# EAGLE design Light module (EAGLE 9.6.2)
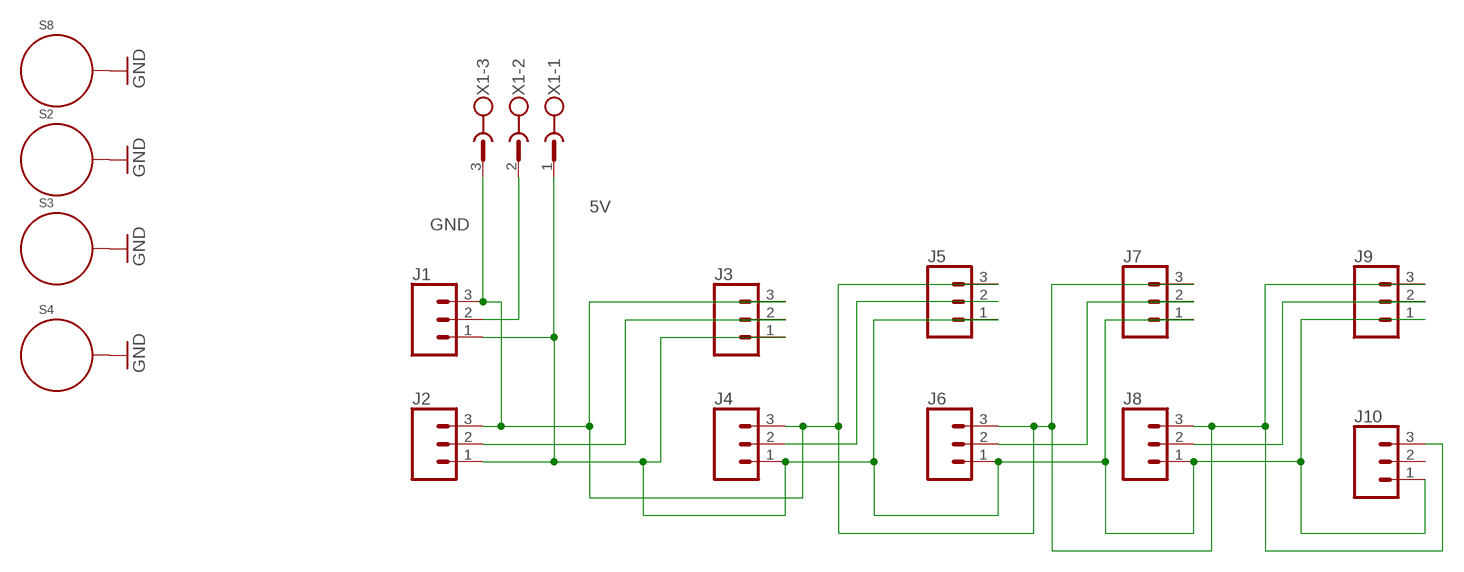
[diagram p0: schematic, sheet 1]

## Parts
J1  JST_CONN_03  [HEADER_PIN_1X03]
J2  JST_CONN_03  [HEADER_PIN_1X03]
J3  JST_CONN_03  [HEADER_PIN_1X03]
J4  JST_CONN_03  [HEADER_PIN_1X03]
J5  JST_CONN_03  [HEADER_PIN_1X03]
J6  JST_CONN_03  [HEADER_PIN_1X03]
J7  JST_CONN_03  [HEADER_PIN_1X03]
J8  JST_CONN_03  [HEADER_PIN_1X03]
J9  JST_CONN_03  [HEADER_PIN_1X03]
J10  JST_CONN_03  [HEADER_PIN_1X03]
S2  STANDOFF_ELECTRICAL5-32  [STANDOFF_ELECTRICAL_5_32]
S3  STANDOFF_ELECTRICAL5-32  [STANDOFF_ELECTRICAL_5_32]
S4  STANDOFF_ELECTRICAL5-32  [STANDOFF_ELECTRICAL_5_32]
S8  STANDOFF_ELECTRICAL5-32  [STANDOFF_ELECTRICAL_5_32]
X1  PHOENIX_508_3PIN  [PHOENIX_508_3PIN]

## Nets
5V [PWR]: J1.1 J2.1 J3.1 J4.1 J5.1 J6.1 J7.1 J8.1 J9.1 J10.1 X1.1
GND [PWR]: J1.3 J2.3 J3.3 J4.3 J5.3 J6.3 J7.3 J8.3 J9.3 J10.3 S2.P1 S3.P1 S4.P1 S8.P1 X1.3
N$2: J1.2 X1.2
N$5: J2.2 J3.2
N$8: J4.2 J5.2
N$11: J6.2 J7.2
N$14: J8.2 J9.2
Unconnected: J10.2

## Library data of the parts
J1-J10 = OMSI_Default_V1:JST_CONN_03: Multi connection point. Often used as Generic Header-pin footprint for 0.1 inch spaced/style header connections On any of the 0.1 inch spaced packages, you can populate with these: Break Away Headers - Straight <https://www.sparkfun.com/products/116> (PRT-00116) Break Away Male Headers - Right Angle <https://www.sparkfun.com/products/553> (PRT-00553) Female Headers <https://www.sparkfun.com/products/115> (PRT-00115) Break Away Headers - Machine Pin <https://www.sparkfun.com/products/117> (PRT-00117) Break Away Female Headers - Swiss Machine Pin <https://www.sparkfun.com/products/743> (PRT-00743) Stackable Header - 3 Pin (Female, 0.1") <https://www.sparkfun.com/products/13875> (PRT-13875) For SCREWTERMINALS and SPRING TERMINALS visit here: Screw Terimnals on SparkFun.com <https://www.sparkfun.com/search/results?term=Screw+Terminals> (5mm/3.5mm/2.54mm spacing) This device is also useful as a general connection point to wire up your design to another part of your project. Our various solder wires solder well into these plated through hole pads. Hook-Up Wire - Assortment (Stranded, 22 AWG) <https://www.sparkfun.com/products/11375> (PRT-11375) Hook-Up Wire - Assortment (Solid Core, 22 AWG) <https://www.sparkfun.com/products/11367> (PRT-11367) View the entire wire category on our website here <https://www.sparkfun.com/categories/141> Special notes: Molex polarized connector foot print use with SKU : PRT-08232 with associated crimp pins and housings.; PROD_ID: CONN-11912; SF_SKU: PRT-08433
S2-S4 S8 = th_libraries:STANDOFF_ELECTRICAL: A standoff intended to be an electrically connected point. Pad size and stop size allow for a #8 Phillips pan screw head to make a solid connection to the board. Added 144mill drill hole that fits my normal wood screw
X1 = OMSI_Default_V1:PHOENIX_508_3PIN: PHOENIX; MF: FARNELL; MPN: 1757255; OC_FARNELL: 3705183; OC_NEWARK: 71C4162

## Net classes
0 default: width 0.406 mm, drill 0.483 mm
1 PWR: width 0.635 mm, clearance 0.381 mm

## Board
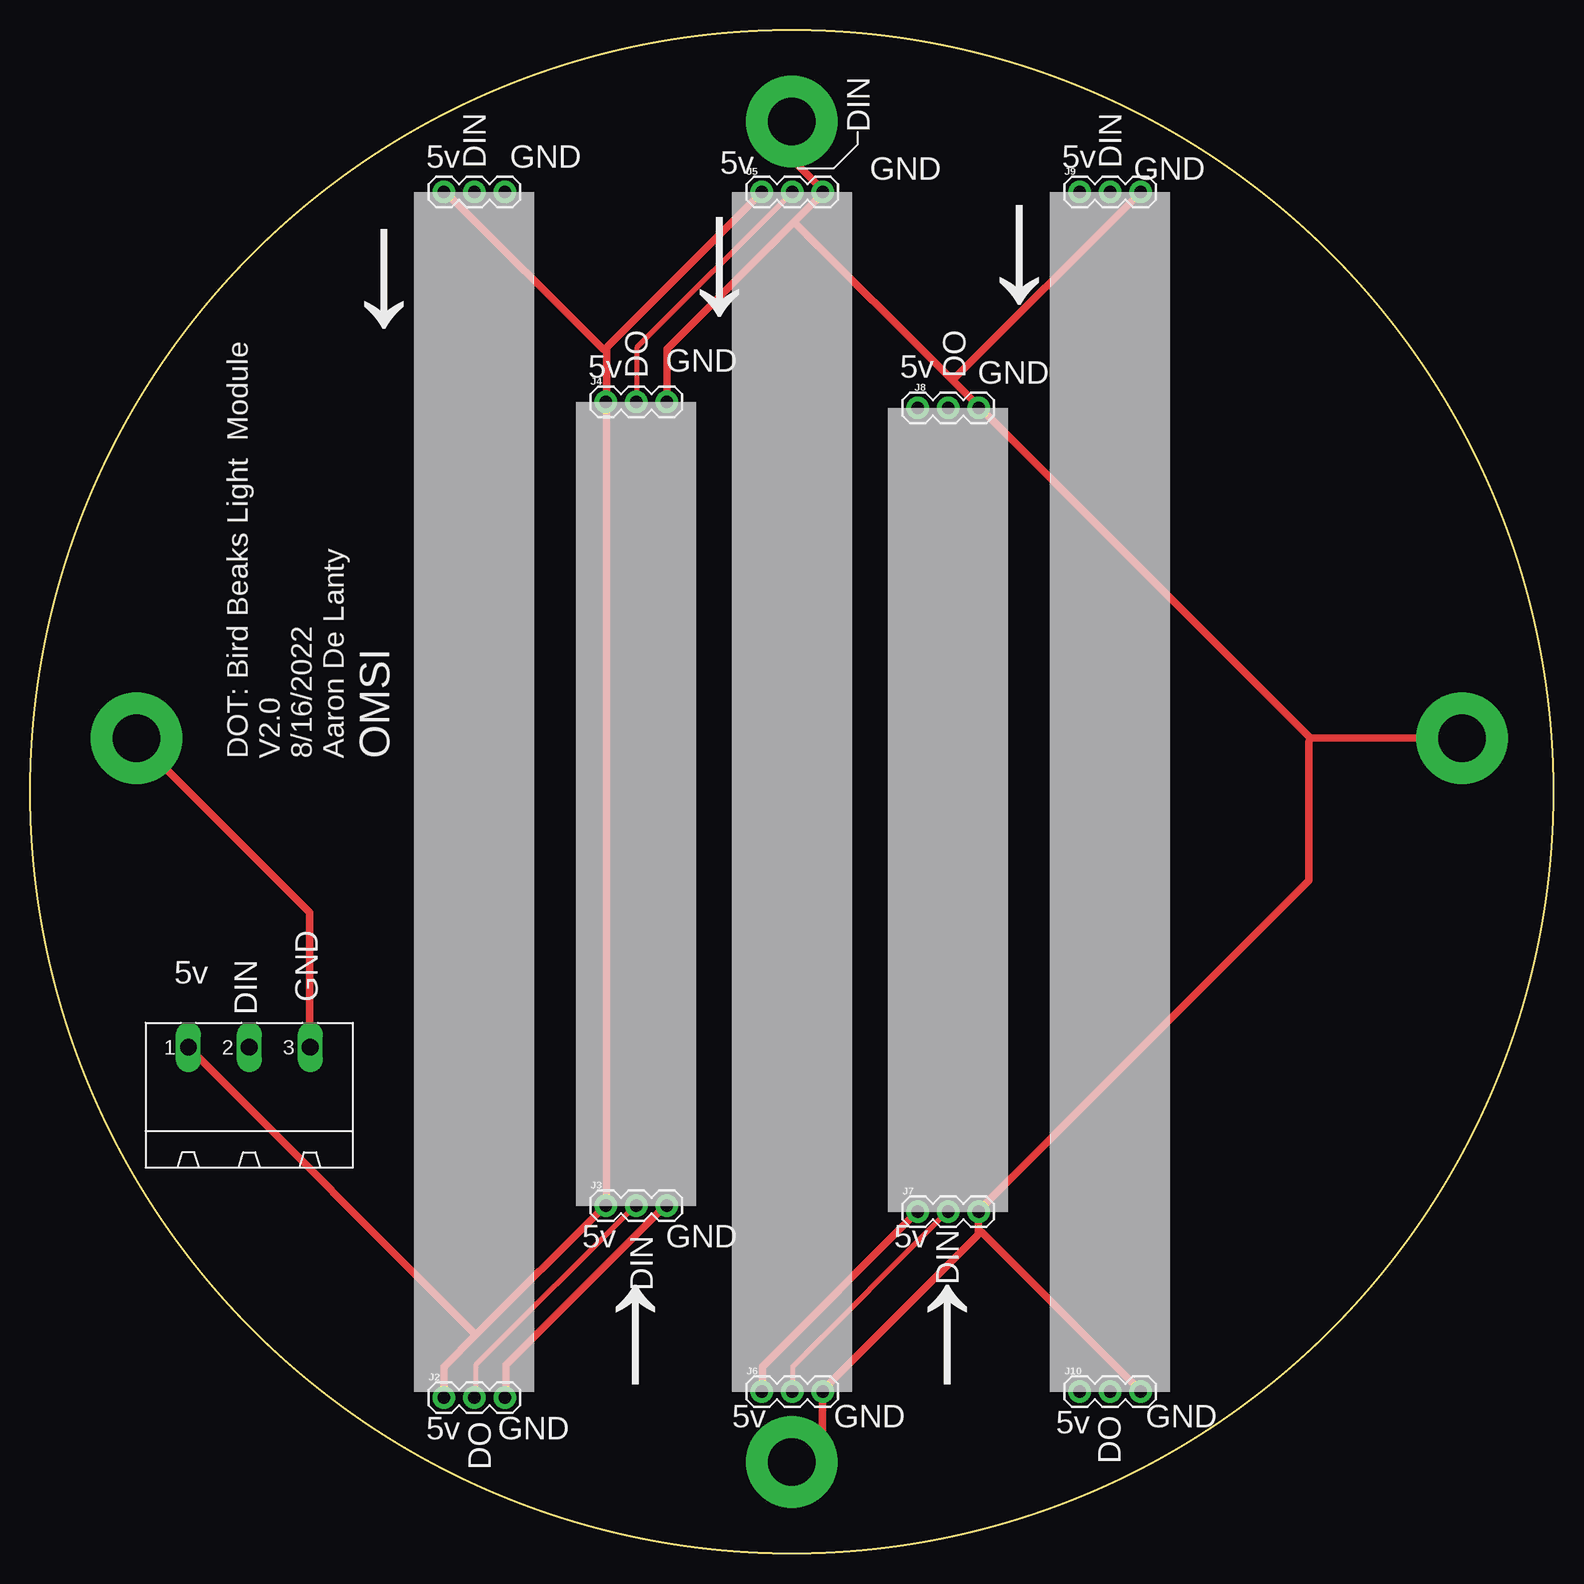
[diagram p1: board, top side]
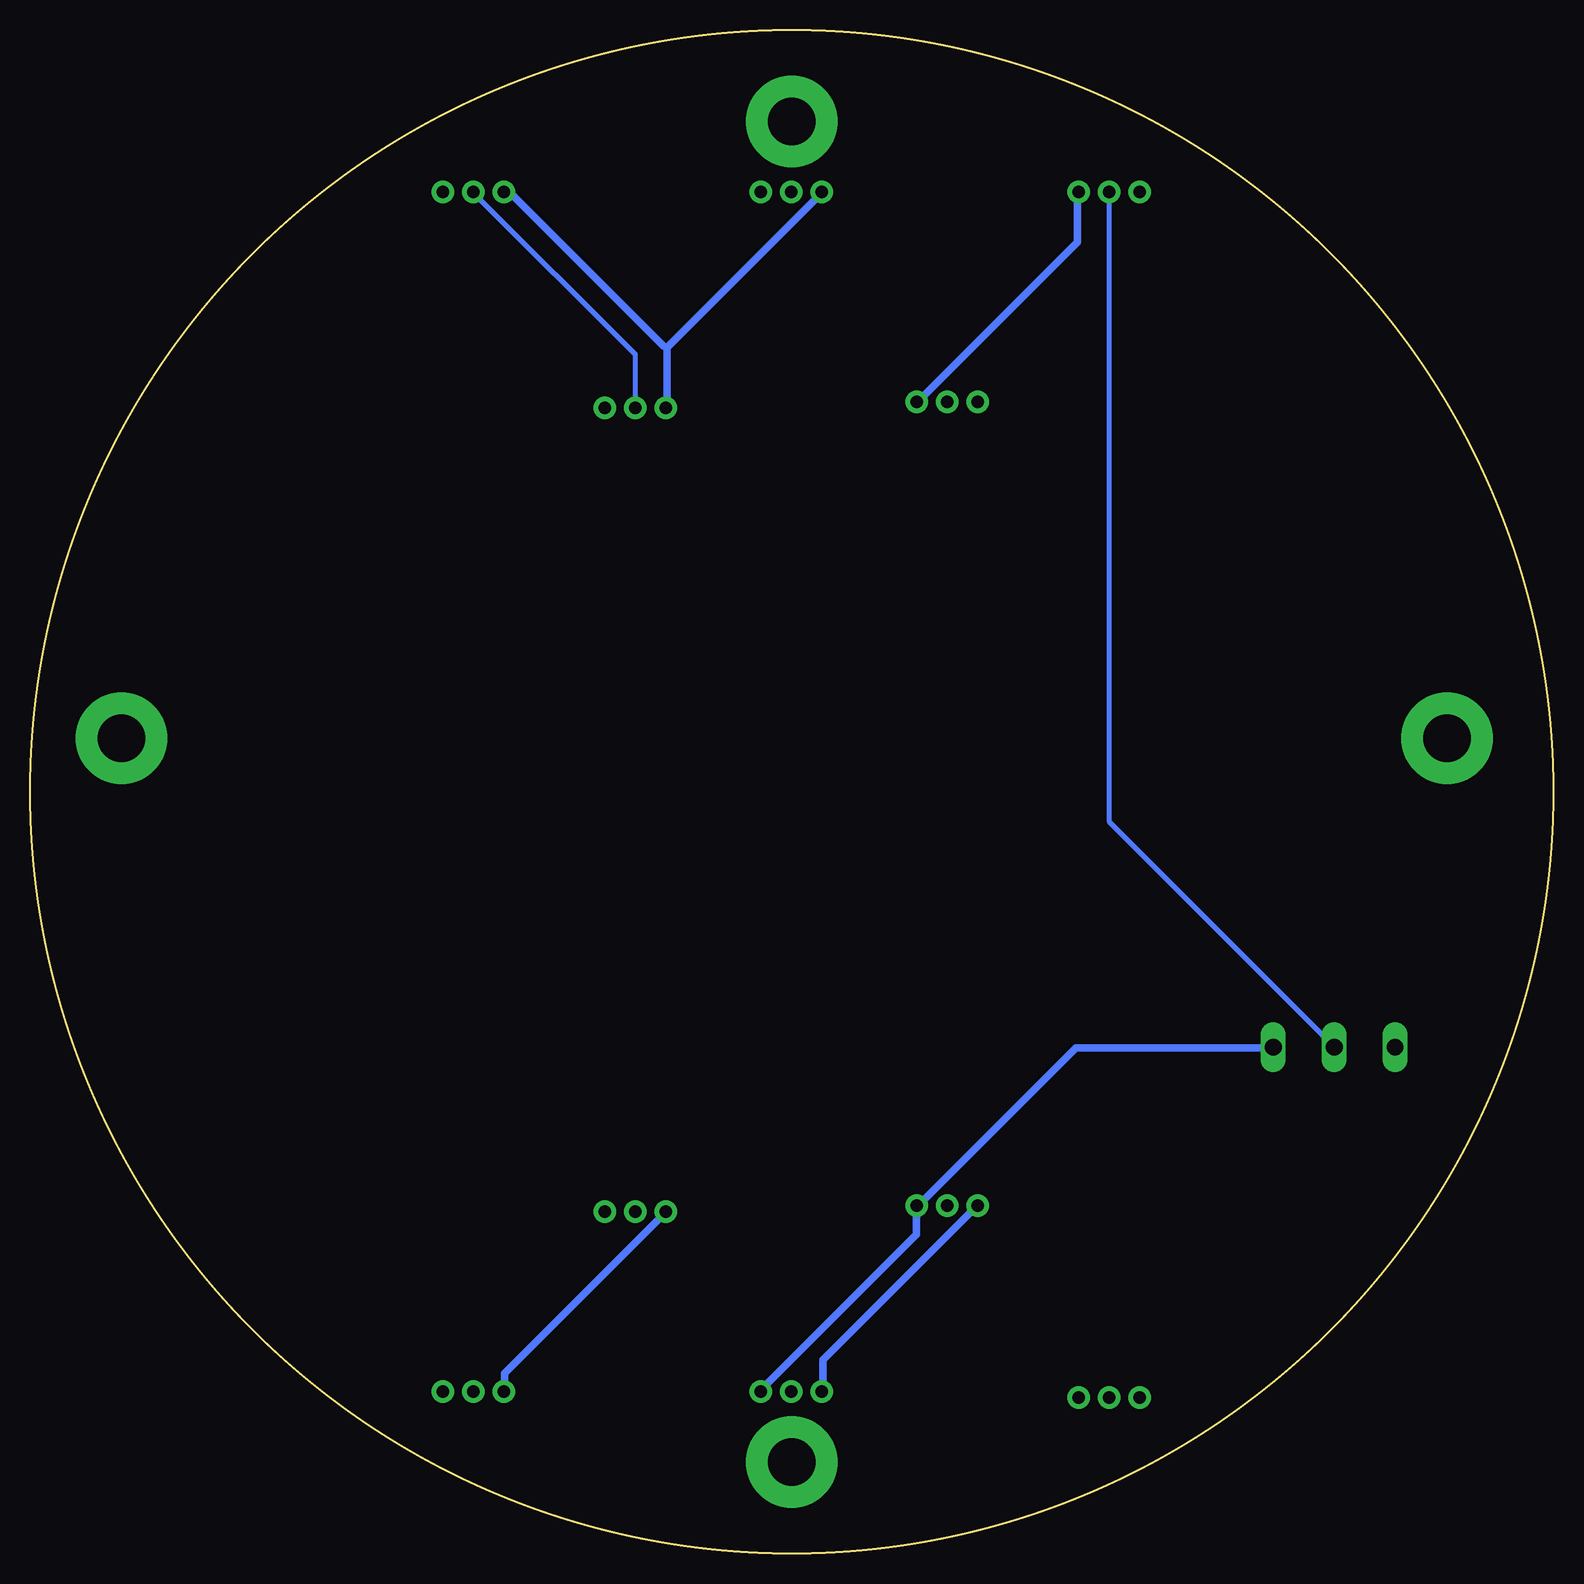
[diagram p2: board, bottom side, seen from below]

Size 127 x 127 mm. Coordinates in mm from the lower left corner, seen from the top.
Outline: circle at 63.5,63.5 radius 63.5
Copper layers (1*16): Top 0.035mm / dielectric 1.5mm / Bottom 0.035mm
Design rules "default": minimum track width 6mil, minimum drill 0.35mm, track to track 6mil, track to pad 6mil, pad to pad 6mil, via to via 6mil, smd to smd 6mil, copper to edge 40mil, drill to drill 6mil, minimum pad ring 10mil, minimum via ring 8mil, stop-mask expansion 4mil, vias tented up to drill 0mil, thermal gap 10mil

### Footprints (pad centres in the part's own frame; a part is rotated, then mirrored left to right if it is on the bottom)
HEADER_PIN_1X03 = drill 1.016 pad 1.88: 1 0,0; 2 2.54,0; 3 5.08,0
STANDOFF_ELECTRICAL_5_32 = drill 3.969 pad 7.62: P1 0,0
PHOENIX_508_3PIN = drill 1.397 long: 1 -5.08,5.08; 2 0,5.08; 3 5.08,5.08

### Placement (x,y rotation side)
J1  34.5,113.5 0 top
J2  34.5,13 0 top
J3  48,29 0 top
J4  48,96 0 top
J5  61,113.5 0 top
J6  61,13.5 0 top
J7  74,28.5 0 top
J8  74,95.5 0 top
J9  87.5,113.5 0 top
J10  87.5,13.5 0 top
S2  63.5,7.62 0 top
S3  8.89,67.94 0 top
S4  119.38,67.94 0 top
S8  63.5,119.38 0 top
X1  18.28,37.13 0 top

### Tracks (layer width: path | path; a pad name or v marks a point on that pad's centre or on a via)
5V
  Top 0.635: 48.06,100.38 48.06,100.52 60.91,113.37 J5.1 | 48.06,100.38 48.06,96.05 J4.1 48.06,95.77 48.06,29.27 J3.1 47.92,28.99 37.16,18.24 | J1.1 34.51,113.37 34.78,113.37 47.78,100.38 48.06,100.38 | J6.1 61.05,13.63 61.05,15.58 73.9,28.44 J7.1 | 37.16,18.24 34.51,15.58 34.51,13.07 J2.1 | 37.16,18.24 13.27,42.13 X1.1
  Bottom 0.635: 73.9,100.52 73.9,95.63 J8.1 | 73.9,100.52 61.05,113.37 J5.1 | J9.1 87.45,113.37 86.89,113.37 74.18,100.66 73.9,100.52 | J10.1 87.45,13.63 87.45,15.02 74.04,28.44 J7.1 | J6.1 60.91,13.63 60.91,16.14 48.06,28.99 J3.1
GND
  Top 0.635: 63.7,111 66.08,113.37 J5.3 65.94,113.79 63.56,116.17 63.56,119.38 S8.P1 | 63.7,111 53.09,100.38 53.09,96.05 J4.3 | 63.7,111 76.91,97.8 | 76.91,97.8 79.07,95.63 J8.3 79.35,95.35 106.73,67.97 | 76.91,97.8 92.48,113.37 J9.3 | 106.73,67.97 119.3,67.97 S4.P1 | X1.3 23.33,42.27 23.33,53.44 8.94,67.83 S3.P1 | J2.3 39.67,13.07 39.67,15.72 52.95,28.99 J3.3 | S2.P1 63.56,7.62 66.08,10.13 66.08,13.49 J6.3 66.22,13.77 79.07,26.62 79.07,26.76 | 79.07,26.76 79.07,28.44 J7.3 79.21,28.72 106.59,56.1 106.59,67.69 106.73,67.97 | J10.3 92.48,13.63 79.35,26.76 79.07,26.76
  Bottom 0.635: J1.3 39.67,113.37 39.67,109.32 52.95,96.05 J4.3 | J6.3 66.08,13.63 53.09,26.62 J3.3 52.81,29.13 39.81,42.13 23.47,42.13 X1.3
N$2
  Bottom 0.406: J1.2 37.02,113.37 37.02,60.98 18.3,42.27 X1.2
N$5
  Top 0.406: J2.2 37.16,13.07 37.16,15.72 50.43,28.99 J3.2
N$8
  Top 0.406: J4.2 50.57,96.05 50.57,100.52 63.42,113.37 J5.2
N$11
  Top 0.406: J6.2 63.56,13.63 63.56,15.58 76.42,28.44 J7.2
N$14
  Bottom 0.406: J8.2 76.56,95.63 76.56,99.96 89.97,113.37 J9.2

### Text on the board
tNames: DIN | 5v | DIN | GND | 5v | 5v | DIN | GND | ↓ | GND | ↓ | ↓ | GND | 5v | DO | 5v | DO | GND | DOT: Bird Beaks Light Module / V2.0 / 8/16/2022 / Aaron De Lanty | OMSI | ↓ | DIN | 5v | GND | DIN | DIN | 5v | GND | 5v | ↑ | ↑ | DO | DO | 5v | GND | GND | 5v | GND | 5v